# Altium project GateWay V1.1.PrjPCB
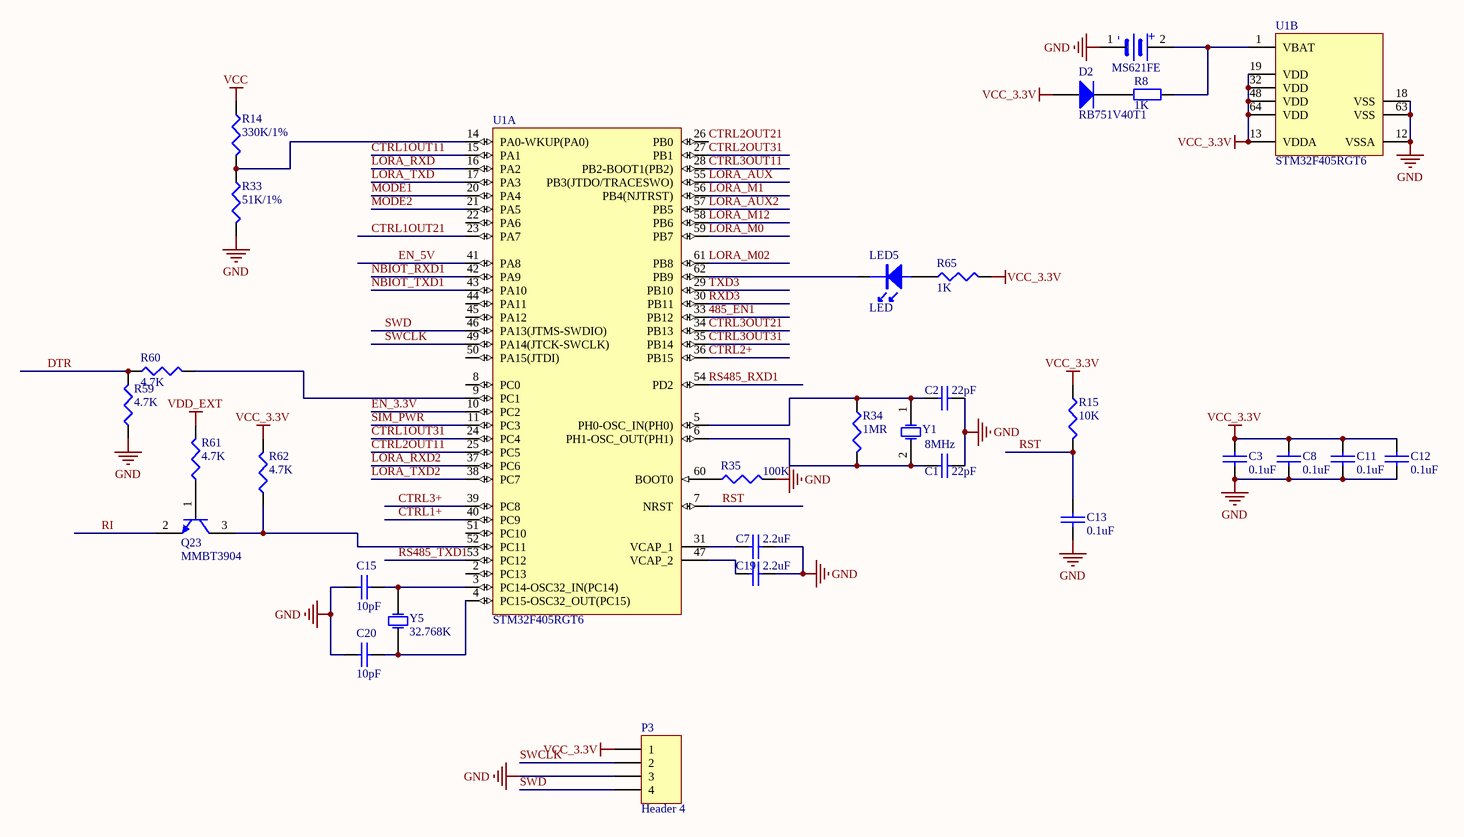
[diagram p0: CPU.SchDoc]
4 sheets, 109 parts. Net scope: global (net labels, ports and power ports of the same name join across sheets).
Board file: GateWay V1.1.PcbDoc
Sheets:
  CPU.SchDoc
  LORA.SchDoc
  nbiot&gps.SchDoc
  POWER.SchDoc

## Sheet CPU.SchDoc
size A3

### Parts
C1  22pF  [0603c]
C2  22pF  [0603c]
C3  0.1uF  [0603c]
C7  2.2uF  [0603c]
C8  0.1uF  [0603c]
C11  0.1uF  [0603c]
C12  0.1uF  [0603c]
C13  0.1uF  [0603c]
C15  10pF  [0603c]
C19  2.2uF  [0603c]
C20  10pF  [0603c]
D2  RB751V40T1  [SOD323]
LED5  LED  [0603LED]
MS621FE  SBatery  [MS621FE]  (value not drawn)
P3  Header 4  [HDR1X4]
Q23  MMBT3904  [SOT23-3]
R8  1K  [0603R]
R14  330K/1%  [0603R]
R15  10K  [0603R]
R33  51K/1%  [0603R]
R34  1MR  [0603R]
R35  100K  [0603R]
R59  4.7K  [0603R]
R60  4.7K  [0603R]
R61  4.7K  [0603R]
R62  4.7K  [0603R]
R65  1K  [0603R]
U1  STM32F405RGT6  [LQFP-64]  (parts A,B of 2)
Y1  8MHz  [CRAY_5032]
Y5  32.768K  [32.768K]

### Nets
GND: C1.1 C2.1 C3.1 C7.1 C8.1 C11.1 C12.1 C13.1 C15.1 C19.1 C20.1 MS621FE.1 P3.3 R33.2 R35.2 R59.1 U1.12(VSSA) U1.18(VSS) U1.63(VSS)
VCC: R14.1
VCC_3.3V: C3.2 C8.2 C11.2 C12.2 D2.1(A) P3.1 R15.1 R62.2 R65.2 U1.13(VDDA) U1.19(VDD) U1.32(VDD) U1.48(VDD) U1.64(VDD)
VDD_EXT: R61.2
485_EN1: U1.33(PB12)
CTRL1+: U1.40(PC9)
CTRL1OUT11: U1.15(PA1)
CTRL1OUT21: U1.23(PA7)
CTRL1OUT31: U1.24(PC4)
CTRL2+: U1.36(PB15)
CTRL2OUT11: U1.25(PC5)
CTRL2OUT21: U1.26(PB0)
CTRL2OUT31: U1.27(PB1)
CTRL3+: U1.39(PC8)
CTRL3OUT11: U1.28(PB2-BOOT1(PB2))
CTRL3OUT21: U1.34(PB13)
CTRL3OUT31: U1.35(PB14)
DTR: R59.2 R60.1
EN_3.3V: U1.10(PC2)
EN_5V: U1.41(PA8)
LORA_AUX: U1.55(PB3(JTDO/TRACESWO))
LORA_AUX2: U1.57(PB5)
LORA_M0: U1.59(PB7)
LORA_M1: U1.56(PB4(NJTRST))
LORA_M02: U1.61(PB8)
LORA_M12: U1.58(PB6)
LORA_RXD: U1.16(PA2)
LORA_RXD2: U1.37(PC6)
LORA_TXD: U1.17(PA3)
LORA_TXD2: U1.38(PC7)
MODE1: U1.20(PA4)
MODE2: U1.21(PA5)
NBIOT_RXD1: U1.42(PA9)
NBIOT_TXD1: U1.43(PA10)
RI: Q23.2(E)
RS485_RXD1: U1.54(PD2)
RS485_TXD1: U1.53(PC12)
RST: C13.2 R15.2 U1.7(NRST)
RXD3: U1.30(PB11)
SIM_PWR: U1.11(PC3)
SWCLK: P3.2 U1.49(PA14(JTCK-SWCLK))
SWD: P3.4 U1.46(PA13(JTMS-SWDIO))
TXD3: U1.29(PB10)
NetC1_2: C1.2 R34.2 U1.6(PH1-OSC_OUT(PH1)) Y1.2(OSC2)
NetC2_2: C2.2 R34.1 U1.5(PH0-OSC_IN(PH0)) Y1.1(OSC1)
NetC7_2: C7.2 U1.31(VCAP_1)
NetC15_2: C15.2 U1.3(PC14-OSC32_IN(PC14)) Y5.1(OSC1)
NetC19_2: C19.2 U1.47(VCAP_2)
NetC20_2: C20.2 U1.4(PC15-OSC32_OUT(PC15)) Y5.2(OSC2)
NetD2_2: D2.2(K) R8.1
NetLED5_1: LED5.1 R65.1
NetLED5_2: LED5.2 U1.62(PB9)
NetMS621FE_2: MS621FE.2 R8.2 U1.1(VBAT)
NetQ23_1: Q23.1(B) R61.1
NetQ23_3: Q23.3(C) R62.1 U1.52(PC11)
NetR14_2: R14.2 R33.1 U1.14(PA0-WKUP(PA0))
NetR35_1: R35.1 U1.60(BOOT0)
NetR60_2: R60.2 U1.9(PC1)

Not connected (* = marked no-connect by the designer): U1 2(PC13) 8(PC0) 22(PA6) 44(PA11) 45(PA12) 50(PA15(JTDI)) 51(PC10)

### Notes on the sheet
- (in symbol SBatery) -; +

### Library data of the parts
C1-C3 C7 C8 C11-C13 C15 C19 C20 = CAP: Capacitor
D2 = Diode: Default Diode; Published: 8-Jun-2000; LatestRevisionDate: 17-Jul-2002; LatestRevisionNote: Re-released for DXP Platform.; PackageDocument: Sep-1996; PackageReference: SMC; Publisher: Altium Limited; Code_JEDEC: DO-214-AB
P3 = Header 4: Header, 4-Pin; LatestRevisionDate: 17-Jul-2002; LatestRevisionNote: Re-released for DXP Platform.; Publisher: Altium Limited
Q23 = NPN
R8 = Res2: Resistor; Published: 8-Jun-2000; LatestRevisionDate: 17-Jul-2002; LatestRevisionNote: Re-released for DXP Platform.; PackageReference: AXIAL-0.4; Publisher: Altium Limited; Value: 1K
R14 R15 R33-R35 = Res3: Resistor; Published: 8-Jun-2000; LatestRevisionDate: 29-May-2009; LatestRevisionNote: IPC-7351 Footprint Added.; PackageReference: J1-0603; Publisher: Altium Limited; PackageDescription: Chip Resistor
R59-R62 R65 = RES1: P: 1/8W
U1 = STM32F405RGT6: ARM Cortex-M4 32-bit MCU+FPU, 210 DMIPS, 1024 kB Flash, 192 kB Internal RAM, 51 I/Os, 64-pin LQFP, -40 to 85 degC, Tray; Manufacturer: STMicroelectronics; D/A Converter: 2x12-bit; FLASH Size (Prog) (kB): 1024; I/Os (High Current): 51; Internal RAM Size (kB): 192; Operating Frequency(F) (Processor speed) (MHz): 168; Supply Voltage(Vcc) max (V): 3.6; Supply Voltage(Vcc) min (V): 1.8; DatasheetVersion: Rev. 4; PackageVersion: Rev. 4, 06/2013; PackageReference: LQFP64; PackageDescription: 64-Pin Low Profile Quad Flat Package, 10 x 10 mm Body, 0.5 mm Pitch; Supplier 1: Digi-Key; Supplier Part Number 1: 497-11767-ND; Supplier 2: Farnell; Supplier Part Number 2: 2064363; Supplier 3: Newark; Supplier Part Number 3: 73T2329; Supplier 4: Mouser; Supplier Part Number 4: 511-STM32F405RGT6; Core: ARM Cortex-M4; Packing: Tray; Mounting Technology: Surface Mount; PartNumber: STM32F405RGT6; ComponentLink1Description: Manufacturer URL; ComponentLink1URL: http://www.st.com/web/en/home.html; ComponentLink2Description: Datasheet; ComponentLink2URL: http://www.st.com/st-web-ui/static/active/en/resource/technical/document/datasheet/DM00037051.pdf; ComponentLink3Description: Package Specification; ComponentLink3URL: http://www.st.com/st-web-ui/static/active/en/resource/technical/document/datasheet/DM00037051.pdf
Y1 Y5 = XTAL: Crystal Oscillator; Published: 8-Jun-2000; LatestRevisionDate: 17-Jul-2002; LatestRevisionNote: Re-released for DXP Platform.; PackageReference: R38; Publisher: Altium Limited
  Y1: PackageDescription: Crystal, Thru-Hole; 2 Leads; Body 3.1 x 8.2 mm (Dia.xH)

## Sheet LORA.SchDoc
size A4
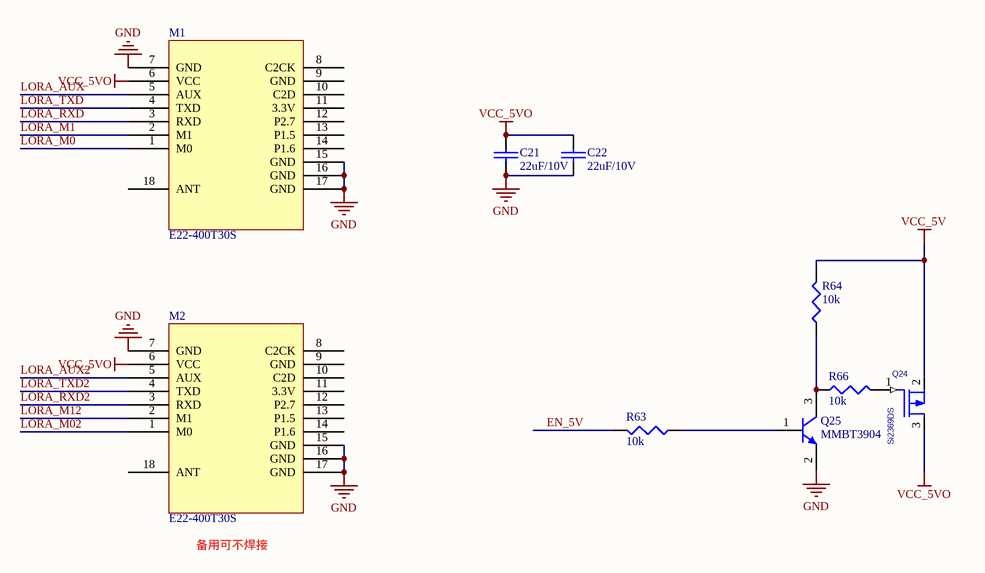
[diagram p1: LORA.SchDoc]

### Parts
C21  22uF/10V  [1206C]
C22  22uF/10V  [1206C]
M1  E22-400T30S  [E22-400T30S]
M2  E22-400T30S  [E22-400T30S]
Q24  Si2369DS  [SOT23]
Q25  MMBT3904  [SOT23-3]
R63  10k  [0603R]
R64  10k  [0603R]
R66  10k  [0603R]

### Nets
GND: C21.2 C22.2 M1.7(GND) M1.15(GND) M1.16(GND) M1.17(GND) M2.7(GND) M2.15(GND) M2.16(GND) M2.17(GND) Q25.2(E)
VCC_5V: Q24.2(DRAIN) R64.2
VCC_5VO: C21.1 C22.1 M1.6(VCC) M2.6(VCC) Q24.3(SOURCE)
EN_5V: R63.2
LORA_AUX: M1.5(AUX)
LORA_AUX2: M2.5(AUX)
LORA_M0: M1.1(M0)
LORA_M1: M1.2(M1)
LORA_M02: M2.1(M0)
LORA_M12: M2.2(M1)
LORA_RXD: M1.3(RXD)
LORA_RXD2: M2.3(RXD)
LORA_TXD: M1.4(TXD)
LORA_TXD2: M2.4(TXD)
NetQ24_1: Q24.1(GATE) R66.2
NetQ25_1: Q25.1(B) R63.1
NetQ25_3: Q25.3(C) R64.1 R66.1

Not connected (* = marked no-connect by the designer): M1 8(C2CK) 9(GND) 10(C2D) 11(3.3V) 12(P2.7) 13(P1.5) 14(P1.6) 18(ANT); M2 8(C2CK) 9(GND) 10(C2D) 11(3.3V) 12(P2.7) 13(P1.5) 14(P1.6) 18(ANT)

### Notes on the sheet
- 备用可不焊接

### Library data of the parts
C21 C22 = CAP: Capacitor
Q24 = MOSFET P_1: Color: RGB(255,  0,  0)
Q25 = NPN
R63 R64 R66 = RES1: P: 1/8W

## Sheet nbiot&gps.SchDoc
size A3
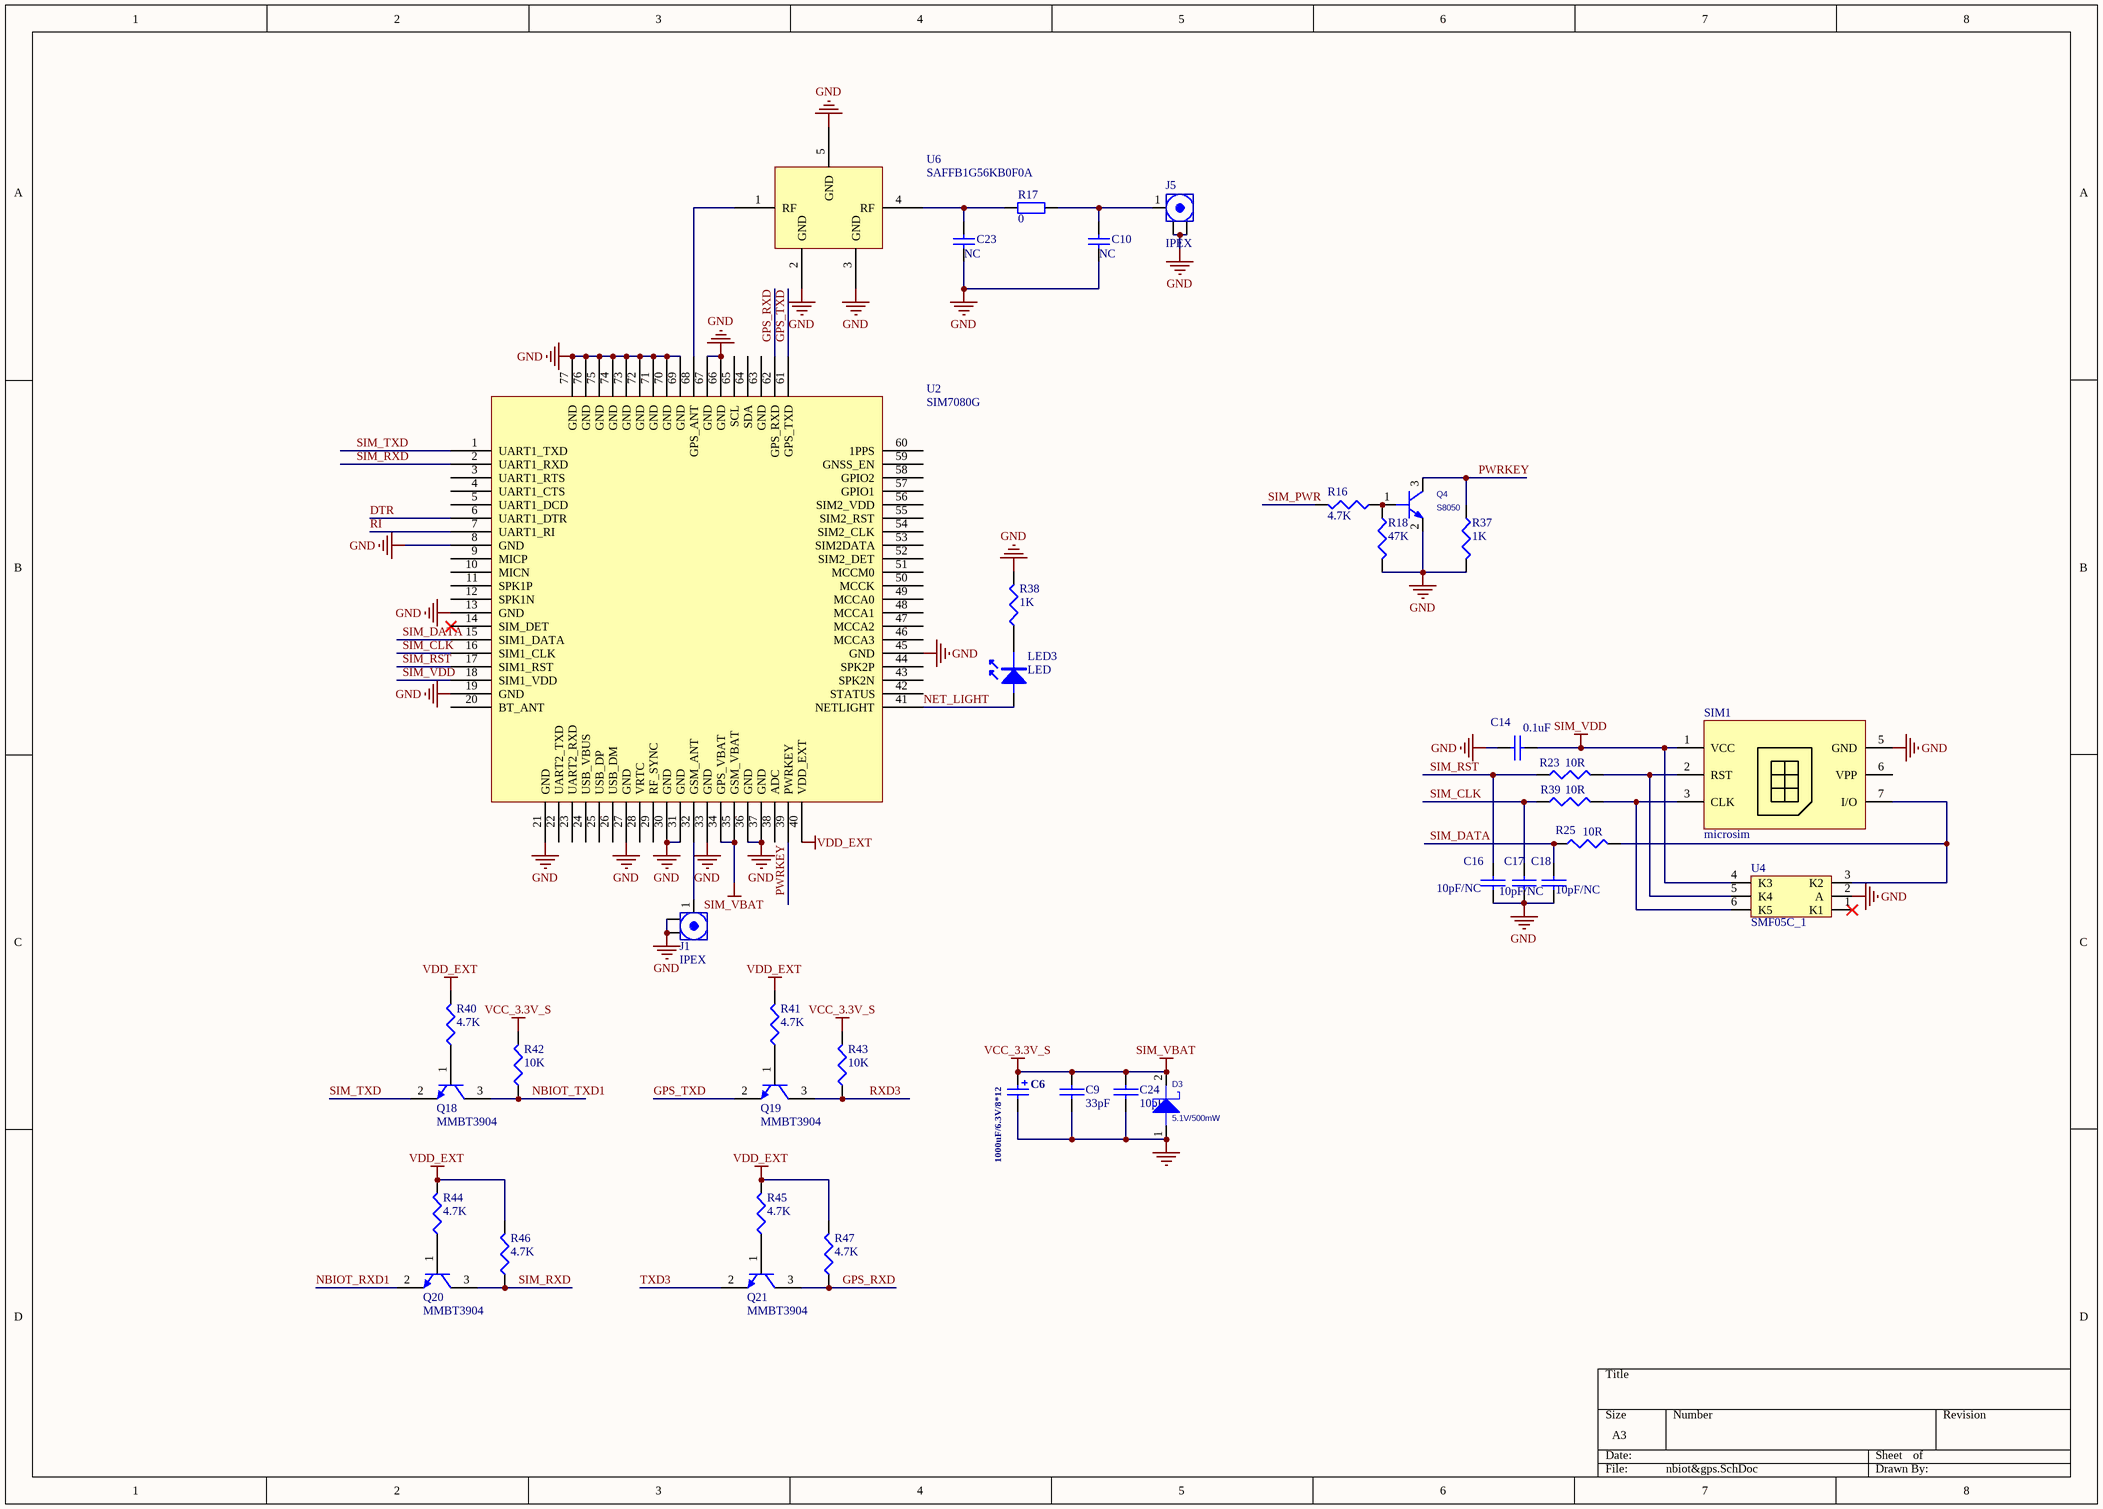
[diagram p2: nbiot&gps.SchDoc]

### Parts
C6  1000uF/6.3V/8*12  [8*12]
C9  33pF  [0603C]
C10  NC  [0603C]
C14  0.1uF  [0603C]
C16  10pF/NC  [0603C]
C17  10pF/NC  [0603C]
C18  10pF/NC  [0603C]
C23  NC  [0603C]
C24  10pF  [0603C]
D3  value 5.1V/500mW  [LL-34(D1206)]  (hidden comment: DIODE_SCHOTTKY_0)
J1  IPEX  [RF-UFL]
J5  IPEX  [RF-UFL]
LED3  LED  [0603LED]
Q4  S8050  [SOT23]
Q18  MMBT3904  [SOT23-3]
Q19  MMBT3904  [SOT23-3]
Q20  MMBT3904  [SOT23-3]
Q21  MMBT3904  [SOT23-3]
R16  4.7K  [0603R]
R17  0  [0603R]
R18  47K  [0603R]
R23  10R  [0603R]
R25  10R  [0603R]
R37  1K  [0603R]
R38  1K  [0603R]
R39  10R  [0603R]
R40  4.7K  [0603R]
R41  4.7K  [0603R]
R42  10K  [0603R]
R43  10K  [0603R]
R44  4.7K  [0603R]
R45  4.7K  [0603R]
R46  4.7K  [0603R]
R47  4.7K  [0603R]
SIM1  microsim  [Nano SIM]
U2  SIM7080G  [SIM868]
U4  SMF05C_1  [SC70-6L]
U6  SAFFB1G56KB0F0A  [SAFFB1G56KB0F0A]

### Nets
GND: C6.2 C9.1 C10.2 C14.1 C16.1 C17.1 C18.1 C23.2 C24.1 D3.1 J1.2(Y) J5.2(Y) Q4.2(E) R18.2 R37.2 R38.2 SIM1.5(GND) U2.8(GND) U2.13(GND) U2.19(GND) U2.21(GND) U2.27(GND) U2.30(GND) U2.31(GND) U2.33(GND) U2.36(GND) U2.37(GND) U2.45(GND) U2.66(GND) U2.67(GND) U2.69(GND) U2.70(GND) U2.71(GND) U2.72(GND) U2.73(GND) U2.74(GND) U2.75(GND) U2.76(GND) U2.77(GND) U4.2(A) U6.2(GND) U6.3(GND) U6.5(GND)
SIM_VBAT: C6.1 C9.2 C24.2 D3.2 R42.2 R43.2 U2.34(GPS_VBAT) U2.35(GSM_VBAT)  [also labelled VCC_3.3V_S]
SIM_VDD: C14.2 SIM1.1(VCC) U2.18(SIM1_VDD) U4.4(K3)
VDD_EXT: R40.2 R41.2 R44.2 R45.2 R46.2 R47.2 U2.40(VDD_EXT)
DTR: U2.6(UART1_DTR)
GPS_RXD: Q21.3(C) R47.1 U2.62(GPS_RXD)
GPS_TXD: Q19.2(E) U2.61(GPS_TXD)
NBIOT_RXD1: Q20.2(E)
NBIOT_TXD1: Q18.3(C) R42.1
NET_LIGHT: LED3.1 U2.41(NETLIGHT)
PWRKEY: Q4.3(C) R37.1 U2.39(PWRKEY)
RI: U2.7(UART1_RI)
RXD3: Q19.3(C) R43.1
SIM_CLK: C17.2 R39.1 U2.16(SIM1_CLK)
SIM_DATA: C18.2 R25.1 U2.15(SIM1_DATA)
SIM_PWR: R16.2
SIM_RST: C16.2 R23.1 U2.17(SIM1_RST)
SIM_RXD: Q20.3(C) R46.1 U2.2(UART1_RXD)
SIM_TXD: Q18.2(E) U2.1(UART1_TXD)
TXD3: Q21.2(E)
NetC10_1: C10.1 J5.1(X) R17.2
NetC23_1: C23.1 R17.1 U6.4(RF)
NetJ1_1: J1.1(X) U2.32(GSM_ANT)
NetLED3_2: LED3.2 R38.1
NetQ4_1: Q4.1(B) R16.1 R18.1
NetQ18_1: Q18.1(B) R40.1
NetQ19_1: Q19.1(B) R41.1
NetQ20_1: Q20.1(B) R44.1
NetQ21_1: Q21.1(B) R45.1
NetR23_2: R23.2 SIM1.2(RST) U4.5(K4)
NetR25_2: R25.2 SIM1.7(I/O) U4.3(K2)
NetR39_2: R39.2 SIM1.3(CLK) U4.6(K5)
NetU2_68: U2.68(GPS_ANT) U6.1(RF)

Not connected (* = marked no-connect by the designer): SIM1 6(VPP); U2 3(UART1_RTS) 4(UART1_CTS) 5(UART1_DCD) 9(MICP) 10(MICN) 11(SPK1P) 12(SPK1N) 14(SIM_DET)* 20(BT_ANT) 22(UART2_TXD) 23(UART2_RXD) 24(USB_VBUS) 25(USB_DP) 26(USB_DM) 28(VRTC) 29(RF_SYNC) 38(ADC) 42(STATUS) 43(SPK2N) 44(SPK2P) 46(MCCA3) 47(MCCA2) 48(MCCA1) 49(MCCA0) 50(MCCK) 51(MCCM0) 52(SIM2_DET) 53(SIM2DATA) 54(SIM2_CLK) 55(SIM2_RST) 56(SIM2_VDD) 57(GPIO1) 58(GPIO2) 59(GNSS_EN) 60(1PPS) 63(GND) 64(SDA) 65(SCL); U4 1(K1)*

### Library data of the parts
C6 = Cap Pol3: Polarized Capacitor (Surface Mount); PackageReference: C10*10.2
C9 C14 C16-C18 C24 = CAP: Capacitor
C10 C23 = Cap: Capacitor; Value: 0.1uF/10V; Published: 8-Jun-2000; LatestRevisionDate: 17-Jul-2002; LatestRevisionNote: Re-released for DXP Platform.; PackageReference: RAD-0.3; Publisher: Altium Limited
D3 = DIODE_SCHOTTKY_0: PCB DECAL: DO_214AC; Source_Path: E:\AIH\WORK\A\LIBRARY1.OLB
J1 J5 = ANT
Q4 = 2N1069_1: PspiceTemplate: Q^@REFDES %C %B %E
Q18-Q21 = NPN
R16 R18 R23 R25 R37-R47 = RES1: P: 1/8W
R17 = Res2: Resistor; Published: 8-Jun-2000; LatestRevisionDate: 17-Jul-2002; LatestRevisionNote: Re-released for DXP Platform.; PackageReference: AXIAL-0.4; Publisher: Altium Limited; Value: 0
U2 = SIM868E/SIM868
U4 = SMF05C_1: TVS
U6 = SAFFB1G56KBOFA

## Sheet POWER.SchDoc
size A3
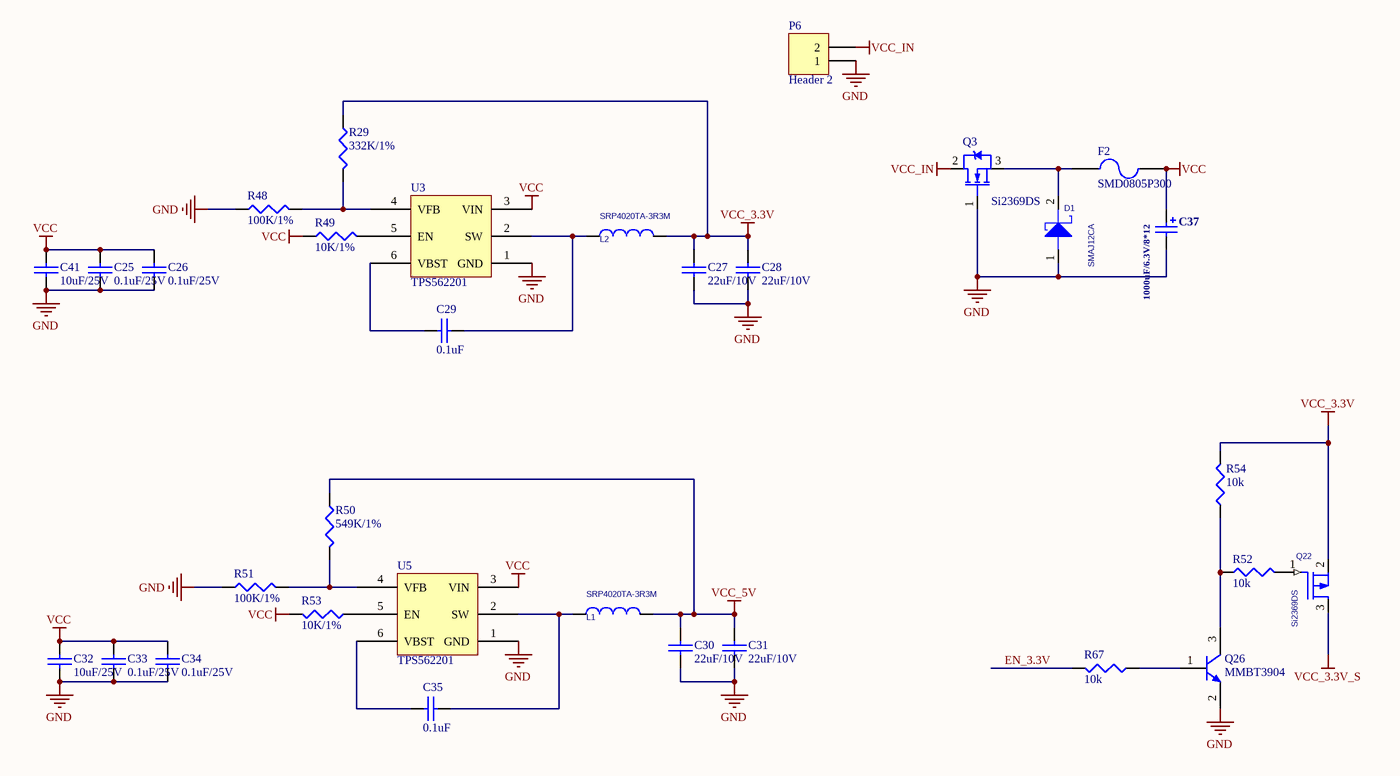
[diagram p3: POWER.SchDoc]

### Parts
C25  0.1uF/25V  [0603C]
C26  0.1uF/25V  [0603C]
C27  22uF/10V  [1206C]
C28  22uF/10V  [1206C]
C29  0.1uF  [0603C]
C30  22uF/10V  [1206C]
C31  22uF/10V  [1206C]
C32  10uF/25V  [0603C]
C33  0.1uF/25V  [0603C]
C34  0.1uF/25V  [0603C]
C35  0.1uF  [0603C]
C37  1000uF/6.3V/8*12  [8*12]
C41  10uF/25V  [0603C]
D1  SMAJ12CA  [SMA]
F2  SMD0805P300  [0805R]
L1  SRP4020TA-3R3M  [CD_4*4]
L2  SRP4020TA-3R3M  [CD_4*4]
P6  Header 2  [2X2.54MMZ]
Q3  Si2369DS  [sot23-3]
Q22  Si2369DS  [SOT23]
Q26  MMBT3904  [SOT23-3]
R29  332K/1%  [0603R]
R48  100K/1%  [0603R]
R49  10K/1%  [0603R]
R50  549K/1%  [0603R]
R51  100K/1%  [0603R]
R52  10k  [0603R]
R53  10K/1%  [0603R]
R54  10k  [0603R]
R67  10k  [0603R]
U3  TPS562201  [SOT-23-6]
U5  TPS562201  [SOT-23-6]

### Nets
GND: C25.1 C26.1 C27.2 C28.2 C30.2 C31.2 C32.1 C33.1 C34.1 C37.2 C41.1 D1.1 P6.1 Q3.1(G) Q26.2(E) R48.1 R51.1 U3.1(GND) U5.1(GND)
VCC: C25.2 C26.2 C32.2 C33.2 C34.2 C37.1 C41.2 F2.2 R49.1 R53.2 U3.3(VIN) U5.3(VIN)
VCC_3.3V: C27.1 C28.1 L2.2 Q22.2(DRAIN) R29.1 R54.2
VCC_3.3V_S: Q22.3(SOURCE)  [project net SIM_VBAT]
VCC_5V: C30.1 C31.1 L1.2 R50.1
VCC_IN: P6.2 Q3.2(D)
EN_3.3V: R67.2
NetC29_1: C29.1 L2.1 U3.2(SW)
NetC29_2: C29.2 U3.6(VBST)
NetC35_1: C35.1 L1.1 U5.2(SW)
NetC35_2: C35.2 U5.6(VBST)
NetD1_2: D1.2 F2.1 Q3.3(S)
NetQ22_1: Q22.1(GATE) R52.2
NetQ26_1: Q26.1(B) R67.1
NetQ26_3: Q26.3(C) R52.1 R54.1
NetR29_2: R29.2 R48.2 U3.4(VFB)
NetR49_2: R49.2 U3.5(EN)
NetR50_2: R50.2 R51.2 U5.4(VFB)
NetR53_1: R53.1 U5.5(EN)

### Library data of the parts
C25-C35 C41 = CAP: Capacitor
C37 = Cap Pol3: Polarized Capacitor (Surface Mount); PackageReference: C10*10.2
D1 = DIODE_SCHOTTKY_0: as D3 on sheet nbiot&gps; Value: SMAJ12CA
F2 = Fuse 2: Fuse; Published: 8-Jun-2000; LatestRevisionDate: 17-Jul-2002; LatestRevisionNote: Re-released for DXP Platform.; PackageReference: PIN-W2/E2.8; Publisher: Altium Limited
L1 L2 = INDUCTOR_1
P6 = Header 2: Header, 2-Pin; LatestRevisionDate: 17-Jul-2002; LatestRevisionNote: Re-released for DXP Platform.; Publisher: Altium Limited
Q3 = NCE4060K: NMOSFET
Q22 = MOSFET P_1: Color: RGB(255,  0,  0)
Q26 = NPN
R29 R48-R54 R67 = RES1: P: 1/8W

## Nets that join several sheets
GND: CPU (19 pins), LORA (11 pins), nbiot&gps (43 pins), POWER (19 pins)
SIM_VBAT: nbiot&gps (8 pins), POWER (Q22.3)
VCC: CPU (R14.1), POWER (12 pins)
VCC_3.3V: CPU (14 pins), POWER (6 pins)
VCC_5V: LORA (Q24.2 R64.2), POWER (C30.1 C31.1 L1.2 R50.1)
VDD_EXT: CPU (R61.2), nbiot&gps (7 pins)
DTR: CPU (R59.2 R60.1), nbiot&gps (U2.6)
EN_3.3V: CPU (U1.10), POWER (R67.2)
EN_5V: CPU (U1.41), LORA (R63.2)
LORA_AUX: CPU (U1.55), LORA (M1.5)
LORA_AUX2: CPU (U1.57), LORA (M2.5)
LORA_M0: CPU (U1.59), LORA (M1.1)
LORA_M1: CPU (U1.56), LORA (M1.2)
LORA_M02: CPU (U1.61), LORA (M2.1)
LORA_M12: CPU (U1.58), LORA (M2.2)
LORA_RXD: CPU (U1.16), LORA (M1.3)
LORA_RXD2: CPU (U1.37), LORA (M2.3)
LORA_TXD: CPU (U1.17), LORA (M1.4)
LORA_TXD2: CPU (U1.38), LORA (M2.4)
NBIOT_RXD1: CPU (U1.42), nbiot&gps (Q20.2)
NBIOT_TXD1: CPU (U1.43), nbiot&gps (Q18.3 R42.1)
RI: CPU (Q23.2), nbiot&gps (U2.7)
RXD3: CPU (U1.30), nbiot&gps (Q19.3 R43.1)
SIM_PWR: CPU (U1.11), nbiot&gps (R16.2)
TXD3: CPU (U1.29), nbiot&gps (Q21.2)